# Altium schematic sheet ShuntTripDriver.SchDoc
size A4
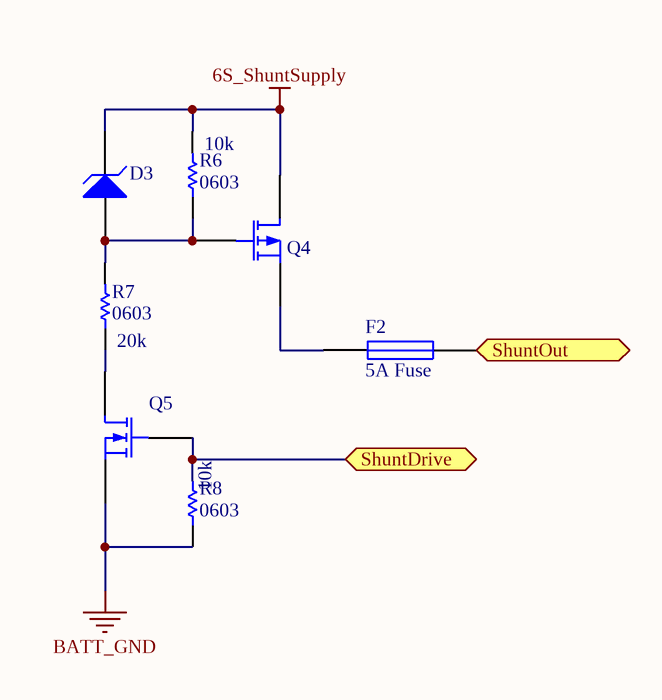
[diagram p0: ShuntTripDriver.SchDoc]

## Parts
D3  (no value)  [0805_M_POL]
F2  5A Fuse  [LITTELFUSE-154]
Q4  PFET 40V 10A  [TO-252 (D-Pak)]  (value not drawn)
Q5  NFET 30V 5A  [SOT23-3]  (value not drawn)
R6  value 10k  package: 0603  [0603_M]  (hidden comment: R)
R7  value 20k  package: 0603  [0603_M]  (hidden comment: R)
R8  value 10k  package: 0603  [0603_M]  (hidden comment: R)

## Ports
ShuntDrive, ShuntOut

## Nets
6S_ShuntSupply: D3.2(K) Q4.1(D) R6.2
BATT_GND: Q5.2(S) R8.1
ShuntDrive: Q5.1(G) R8.2 ; port ShuntDrive
ShuntOut: F2.2 ; port ShuntOut
NetD3_1: D3.1(A) Q4.2(G) R6.1 R7.2
NetF2_1: F2.1 Q4.3(S)
NetQ5_3: Q5.3(D) R7.1

## Library data of the parts
D3 = D Zener: Zener Diode; Supplier 1: Digikey
F2 = FUSE
Q4 = PFET 40V 10A: 10A 40V; Supplier 1: Digi-Key; Supplier Part Number 1: 497-2456-1-ND
R6-R8 = R: Resistor; Supplier 1: Digikey
Q5 = NFET 30V 5A: Supplier 1: Digi-Key; Supplier Part Number 1: IRLML6344TRPBFCT-ND